# EAGLE design Dew-Point-Control (EAGLE 7.1.0)
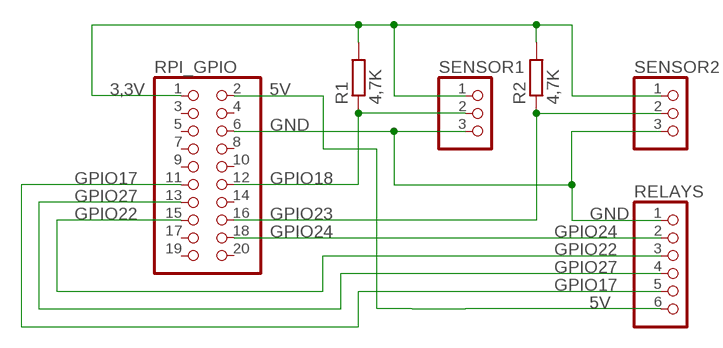
[diagram p0: schematic, sheet 1]

## Parts
R1  4,7K  R-EU_0207/10  [0207/10]
R2  4,7K  R-EU_0207/10  [0207/10]
RELAYS  PINHD-1X6  [1X06]
RPI_GPIO  PINHD-2X10  [2X10]
SENSOR1  PINHD-1X3  [1X03]
SENSOR2  PINHD-1X3  [1X03]

## Nets
3,3V: R1.2 R2.2 RPI_GPIO.1 SENSOR1.1 SENSOR2.1
5V: RELAYS.6 RPI_GPIO.2
GND: RELAYS.1 RPI_GPIO.6 SENSOR1.3 SENSOR2.3
GPIO17: RELAYS.5 RPI_GPIO.11
GPIO18: R1.1 RPI_GPIO.12 SENSOR1.2
GPIO22: RELAYS.3 RPI_GPIO.15
GPIO23: R2.1 RPI_GPIO.16 SENSOR2.2
GPIO24: RELAYS.2 RPI_GPIO.18
GPIO27: RELAYS.4 RPI_GPIO.13
Unconnected: RPI_GPIO.3 RPI_GPIO.4 RPI_GPIO.5 RPI_GPIO.7 RPI_GPIO.8 RPI_GPIO.9 RPI_GPIO.10 RPI_GPIO.14 RPI_GPIO.17 RPI_GPIO.19 RPI_GPIO.20

## Library data of the parts
R1 R2 = rcl:R-EU_: RESISTOR, European symbol
RELAYS = pinhead:PINHD-1X6: PIN HEADER
RPI_GPIO = pinhead:PINHD-2X10: PIN HEADER
SENSOR1 SENSOR2 = pinhead:PINHD-1X3: PIN HEADER

## Board
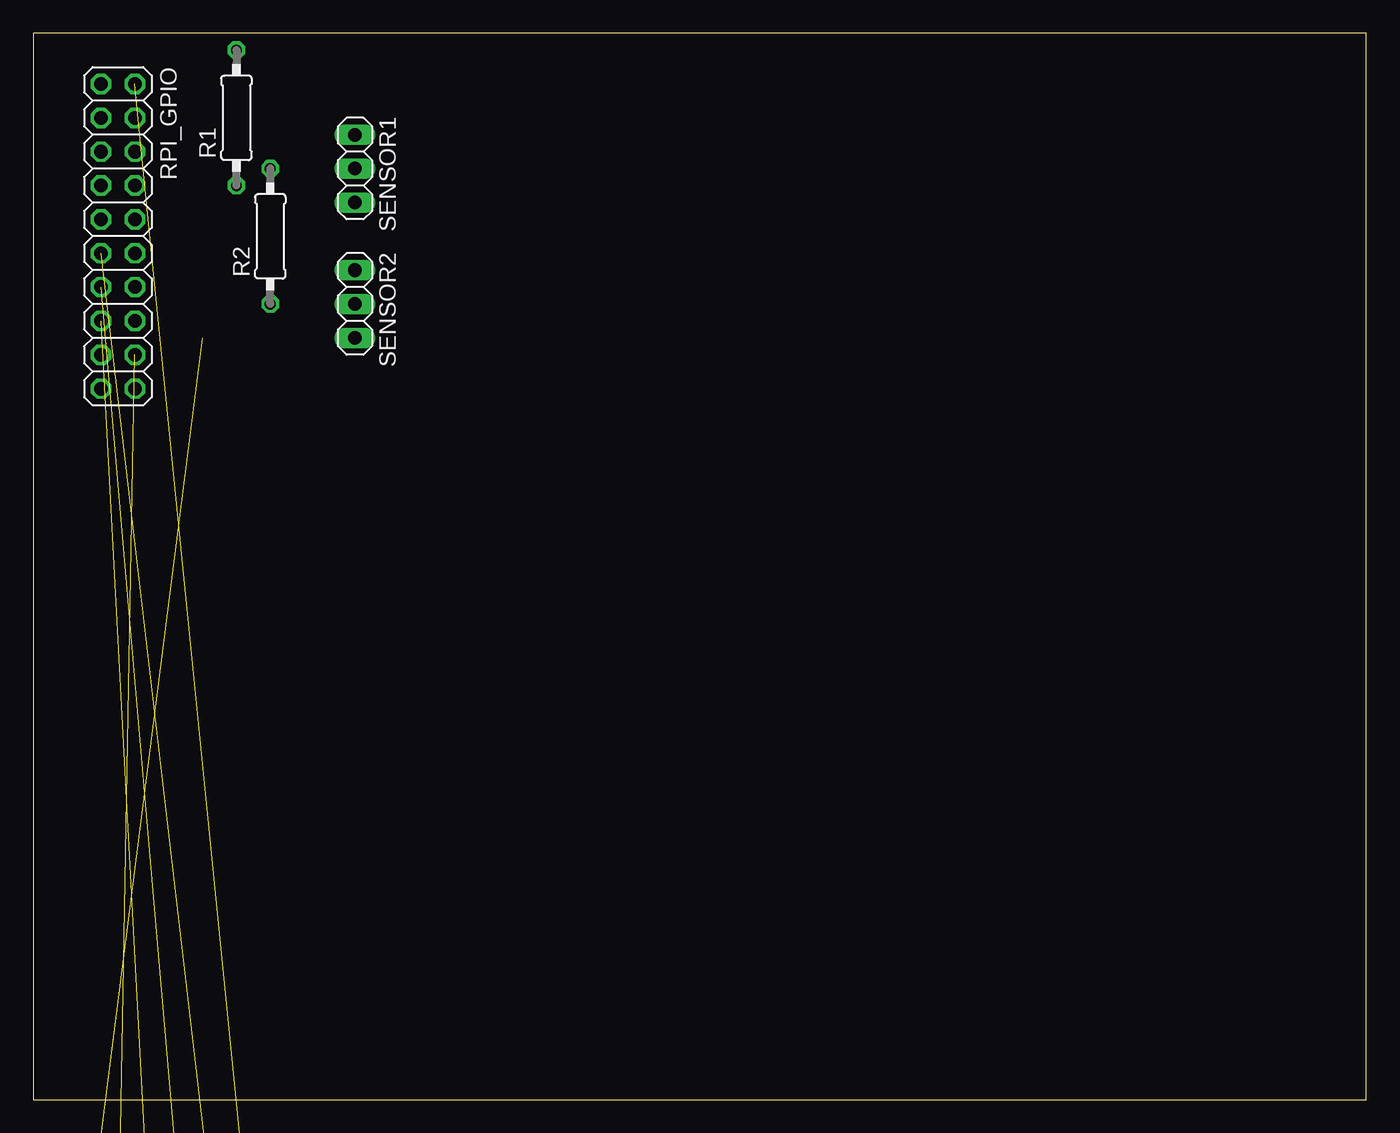
[diagram p1: board, top side]
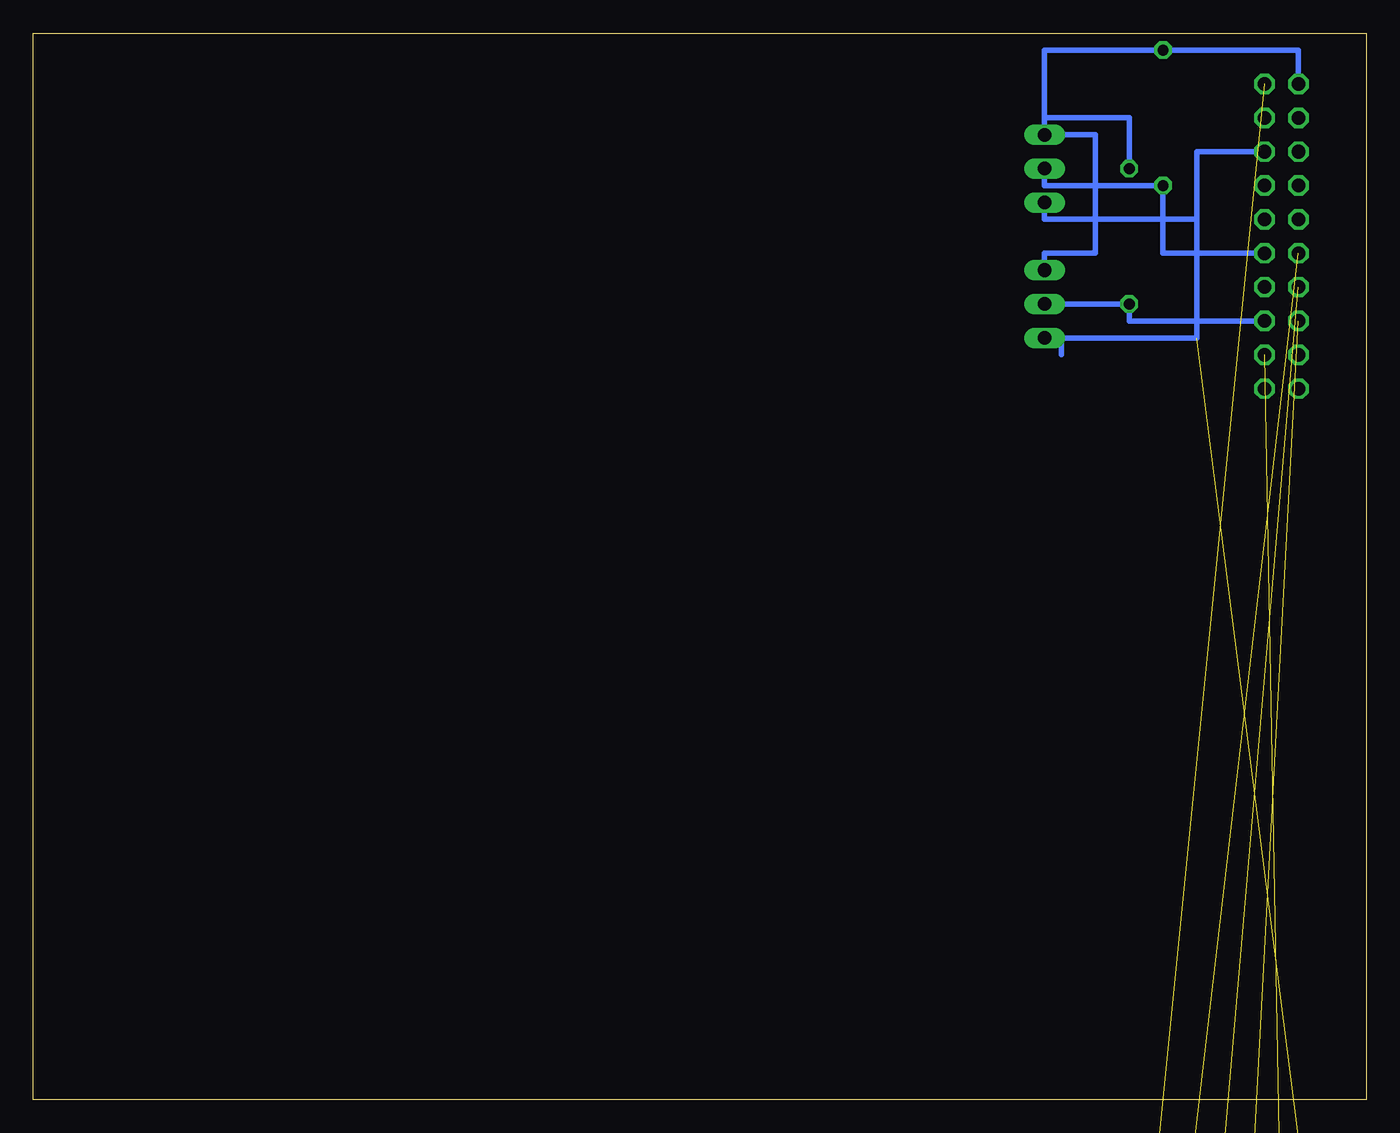
[diagram p2: board, bottom side, seen from below]

Size 100 x 80 mm. Coordinates in mm from the lower left corner, seen from the top.
Outline: 0,0 100,0 100,80 0,80 0,0
Copper layers (1*16): Top 0.035mm / dielectric 1.5mm / Bottom 0.035mm
Design rules "default": minimum track width 10mil, minimum drill 24mil, track to track 8mil, track to pad 8mil, pad to pad 8mil, via to via 8mil, smd to smd 8mil, copper to edge 40mil, drill to drill 8mil, minimum pad ring 10mil, minimum via ring 8mil, stop-mask expansion 4mil, vias tented up to drill 0mil, thermal gap 10mil

### Footprints (pad centres in the part's own frame; a part is rotated, then mirrored left to right if it is on the bottom)
0207/10 = drill 0.813 octagon: 1 -5.08,0; 2 5.08,0
1X06 = drill 1.016 long: 1 -6.35,0; 2 -3.81,0; 3 -1.27,0; 4 1.27,0; 5 3.81,0; 6 6.35,0
2X10 = drill 1.016 octagon: 1 -11.43,-1.27; 2 -11.43,1.27; 3 -8.89,-1.27; 4 -8.89,1.27; 5 -6.35,-1.27; 6 -6.35,1.27; 7 -3.81,-1.27; 8 -3.81,1.27; 9 -1.27,-1.27; 10 -1.27,1.27; 11 1.27,-1.27; 12 1.27,1.27; 13 3.81,-1.27; 14 3.81,1.27; 15 6.35,-1.27; 16 6.35,1.27; 17 8.89,-1.27; 18 8.89,1.27; 19 11.43,-1.27; 20 11.43,1.27
1X03 = drill 1.016 long: 1 -2.54,0; 2 0,0; 3 2.54,0

### Placement (x,y rotation side)
R1  15.24,73.66 90 top
R2  17.78,64.77 90 top
RELAYS  10.16,-12.7 0 top  (outside the outline)
RPI_GPIO  6.35,64.77 270 top
SENSOR1  24.13,69.85 270 top
SENSOR2  24.13,59.69 270 top

### Tracks (layer width: path | path; a pad name or v marks a point on that pad's centre or on a via)
3,3V
  Bottom 0.406: RPI_GPIO.1 5.08,78.74 R1.2 24.13,78.74 24.13,73.66 | 24.13,73.66 SENSOR1.1 20.32,72.39 20.32,63.5 24.13,63.5 SENSOR2.1 | R2.2 17.78,73.66 24.13,73.66
5V  (1 unrouted)
GND  (1 unrouted)
  Bottom 0.406: RPI_GPIO.6 12.7,71.12 12.7,66.04 | 12.7,66.04 24.13,66.04 SENSOR1.3 | SENSOR2.3 22.86,57.15 | 22.86,57.15 22.86,55.88 | 22.86,57.15 12.7,57.15 12.7,66.04
GPIO17  (1 unrouted)
GPIO18
  Bottom 0.406: SENSOR1.2 24.13,68.58 R1.1 15.24,63.5 RPI_GPIO.12
GPIO22  (1 unrouted)
GPIO23
  Bottom 0.406: RPI_GPIO.16 17.78,58.42 R2.1 SENSOR2.2
GPIO24  (1 unrouted)
GPIO27  (1 unrouted)